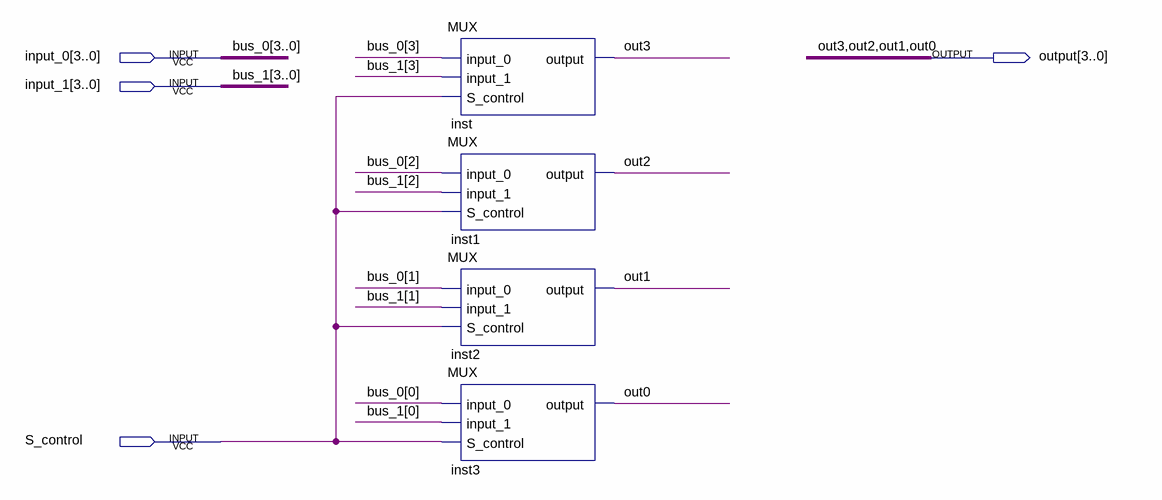
[diagram p0: schematic sheet]
// Quartus schematic 4MUX.bdf as structural Verilog: 4 symbols, 4 pins
module \4MUX  (
  input  [3:0] input_0,
  input  [3:0] input_1,
  input  S_control,
  output [3:0] \output 
);

  MUX inst (.input_0(input_0[3]), .input_1(input_1[3]), .S_control(S_control), .\output (\output [3]));
  MUX inst1 (.input_0(input_0[2]), .input_1(input_1[2]), .S_control(S_control), .\output (\output [2]));
  MUX inst2 (.input_0(input_0[1]), .input_1(input_1[1]), .S_control(S_control), .\output (\output [1]));
  MUX inst3 (.input_0(input_0[0]), .input_1(input_1[0]), .S_control(S_control), .\output (\output [0]));

  // Other names for the same wires on the sheet: bus_0[3:0] = input_0; bus_1[3:0] = input_1; out0 = \output [0];
  //   out1 = \output [1]; out2 = \output [2]; out3 = \output [3]
endmodule
